# Altium project insoleDAQ.PrjPcb
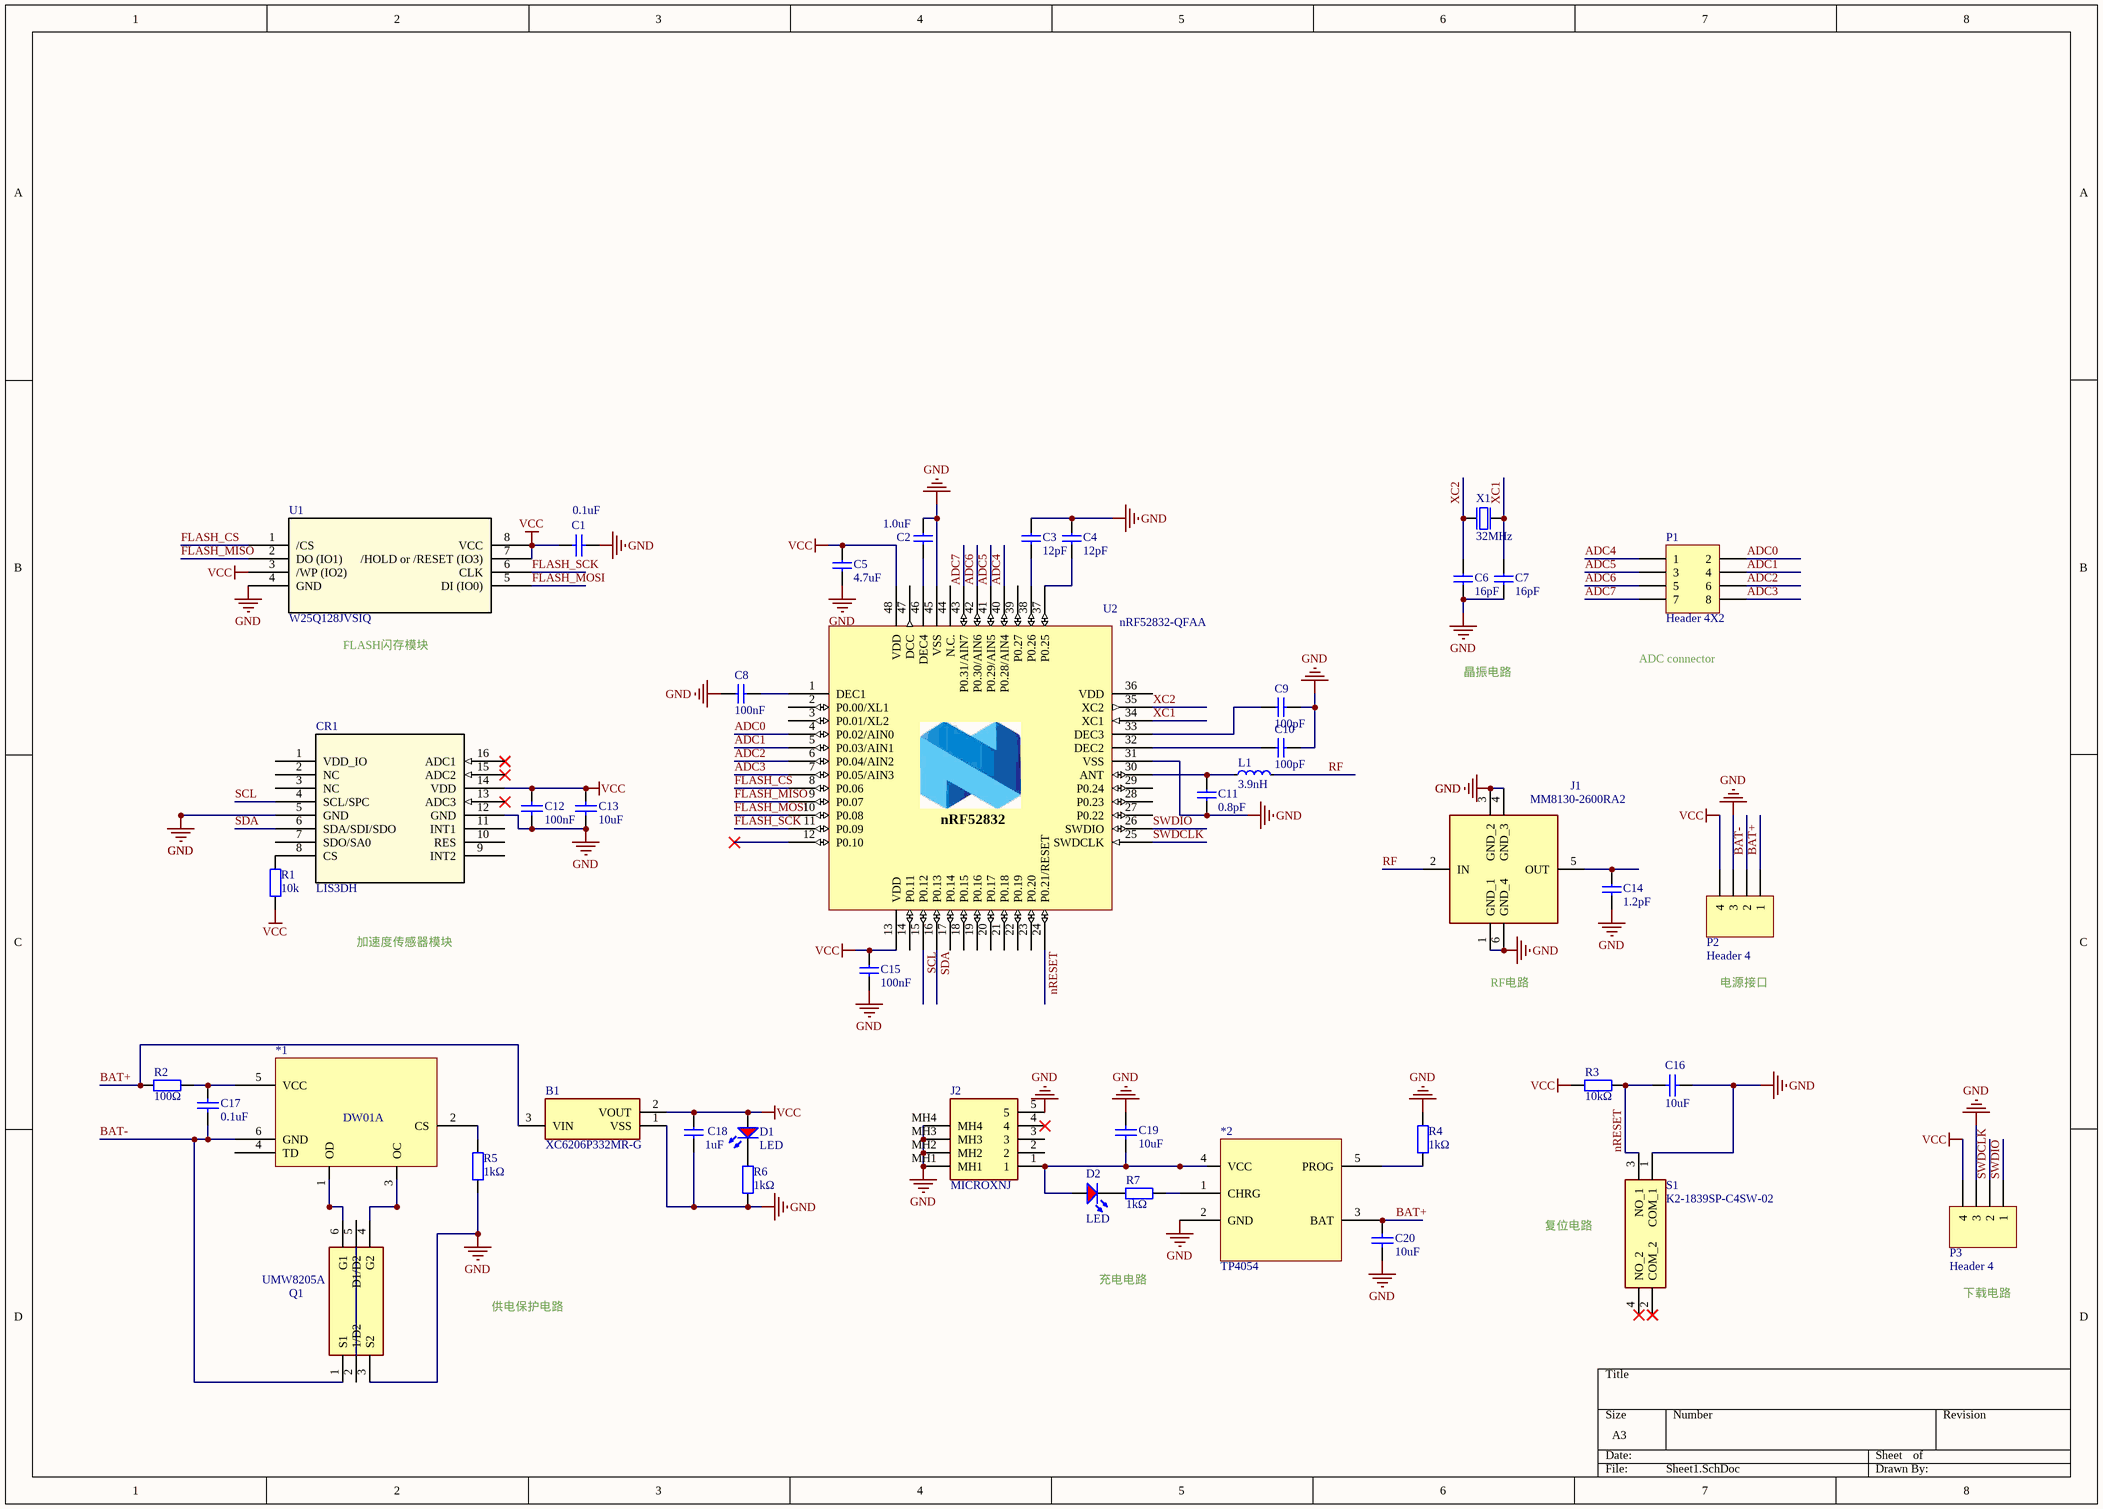
[diagram p0: Sheet1.SchDoc]
1 sheet, 44 parts. Net scope: global (net labels, ports and power ports of the same name join across sheets).
Board file: PCB2.PcbDoc

## Sheet Sheet1.SchDoc
size A3; SheetNumber: 1; SheetTotal: 1

### Parts
*1  DW01A  [DW01]
*2  TP4054  [TP4054]
B1  XC6206P332MR-G  [SOT95P280X130-3N]
C1  0.1uF  [Cap-0603]
C2  1.0uF  [CAPC1608X06L]
C3  12pF  [CAPC1608X06L]
C4  12pF  [CAPC1608X06L]
C5  4.7uF  [CAPC1608X06L]
C6  16pF  [CAPC1608X06L]
C7  16pF  [CAPC1608X06L]
C8  100nF  [CAPC1608X06L]
C9  100pF  [CAPC1608X06L]
C10  100pF  [CAPC1608X06L]
C11  0.8pF  [CAPC1608X06L]
C12  100nF  [Cap-0603]
C13  10uF  [Cap-0603]
C14  1.2pF  [CAPC1608X06L]
C15  100nF  [CAPC1608X06L]
C16  10uF  [Cap-0603]
C17  0.1uF  [Cap-0603]
C18  1uF  [CAPC1608X06L]
C19  10uF  [Cap-0603]
C20  10uF  [Cap-0603]
CR1  LIS3DH  [LGA-16_3x3x1mm_STM]
D1  LED  [LED-0805]
D2  LED  [LED-0805]
J1  MM8130-2600RA2  [MM81302600RA2]
J2  MICROXNJ  [MICROXNJ]
L1  3.9nH  [INDC1608X06L]
P1  Header 4X2  [HDR2X4]
P2  Header 4  [HDR1X4]
P3  Header 4  [HDR1X4]
Q1  UMW8205A  [SOT95P285X140-6N]
R1  10k  [Res-0603]
R2  100Ω  [Res-0603]
R3  10kΩ  [Res-0603]
R4  1kΩ  [Res-0603]
R5  1kΩ  [Res-0603]
R6  1kΩ  [Res-0603]
R7  1kΩ  [Res-0603]
S1  K2-1839SP-C4SW-02  [K21839SPC4SW02]
U1  W25Q128JVSIQ  [SOIC_128JVSIQ_WIN]
U2  nRF52832-QFAA  [QFN40P600X600X90-48N]
X1  32MHz  [BT-XTAL_2016]

### Nets
GND: *2.2(GND) B1.1(VSS) C1.2 C2.2 C3.2 C4.2 C5.1 C6.2 C7.2 C8.1 C9.2 C10.2 C11.1 C12.1 C13.1 C14.1 C15.1 C16.1 C18.1 C19.2 C20.2 CR1.5(GND) CR1.12(GND) J1.1(GND_1) J1.3(GND_2) J1.4(GND_3) J1.6(GND_4) J2.5 J2.MH1 J2.MH2 J2.MH3 J2.MH4 P2.3 P3.3 Q1.3(S2) R4.2 R5.1 R6.1 S1.1(COM_1) U1.4(GND) U2.31(VSS) U2.45(VSS) U2.49(GND) X1.2(GND) X1.4(GND)
VCC: B1.2(VOUT) C1.1 C5.2 C12.2 C13.2 C15.2 C18.2 CR1.14(VDD) D1.1(A) P2.4 P3.4 R1.2 R3.1 U1.3(/WP_(IO2)) U1.7(/HOLD_or_/RESET_(IO3)) U1.8(VCC) U2.13(VDD) U2.48(VDD)
ADC0: P1.2 U2.4(P0.02/AIN0)
ADC1: P1.4 U2.5(P0.03/AIN1)
ADC2: P1.6 U2.6(P0.04/AIN2)
ADC3: P1.8 U2.7(P0.05/AIN3)
ADC4: P1.1 U2.40(P0.28/AIN4)
ADC5: P1.3 U2.41(P0.29/AIN5)
ADC6: P1.5 U2.42(P0.30/AIN6)
ADC7: P1.7 U2.43(P0.31/AIN7)
BAT+: *2.3(BAT) B1.3(VIN) C20.1 P2.1 R2.2
BAT-: *1.6(GND) C17.1 P2.2 Q1.1(S1)
FLASH_CS: U1.1(/CS) U2.8(P0.06)
FLASH_MISO: U1.2(DO_(IO1)) U2.9(P0.07)
FLASH_MOSI: U1.5(DI_(IO0)) U2.10(P0.08)
FLASH_SCK: U1.6(CLK) U2.11(P0.09)
nRESET: C16.2 R3.2 S1.3(NO_1) U2.24(P0.21/RESET)
RF: J1.2(IN) L1.2
SCL: CR1.4(SCL/SPC) U2.15(P0.12)
SDA: CR1.6(SDA/SDI/SDO) U2.16(P0.13)
SWDCLK: P3.2 U2.25(SWDCLK)
SWDIO: P3.1 U2.26(SWDIO)
XC1: C7.1 U2.34(XC1) X1.1(inp)
XC2: C6.1 U2.35(XC2) X1.3(out)
Net*1_1: *1.1(OD) Q1.6(G1)
Net*1_2: *1.2(CS) R5.2
Net*1_3: *1.3(OC) Q1.4(G2)
Net*1_5: *1.5(VCC) C17.2 R2.1
Net*2_1: *2.1(CHRG) R7.1
Net*2_4: *2.4(VCC) C19.1 D2.1(A) J2.1
Net*2_5: *2.5(PROG) R4.1
NetC2_1: C2.1 U2.46(DEC4)
NetC3_1: C3.1 U2.38(P0.26)
NetC4_1: C4.1 U2.37(P0.25)
NetC8_2: C8.2 U2.1(DEC1)
NetC9_1: C9.1 U2.33(DEC3)
NetC10_1: C10.1 U2.32(DEC2)
NetC11_2: C11.2 L1.1 U2.30(ANT)
NetC14_2: C14.2 J1.5(OUT)
NetCR1_8: CR1.8(CS) R1.1
NetD1_2: D1.2(K) R6.2
NetD2_2: D2.2(K) R7.2

Not connected (* = marked no-connect by the designer): *1 4(TD); CR1 1(VDD_IO) 2(NC) 3(NC) 7(SDO/SA0) 9(INT2) 10(RES) 11(INT1) 13(ADC3)* 15(ADC2)* 16(ADC1)*; J2 2 3 4*; Q1 2(1/D2) 5(D1/D2); S1 2(COM_2)* 4(NO_2)*; U2 2(P0.00/XL1) 3(P0.01/XL2) 12(P0.10)* 14(P0.11) 17(P0.14) 18(P0.15) 19(P0.16) 20(P0.17) 21(P0.18) 22(P0.19) 23(P0.20) 27(P0.22) 28(P0.23) 29(P0.24) 36(VDD) 39(P0.27) 44(N.C.) 47(DCC)

### Notes on the sheet
- FLASH闪存模块
- 晶振电路
- ADC connector
- 加速度传感器模块
- RF电路
- 电源接口
- 复位电路
- 供电保护电路
- 充电电路
- 下载电路
- (in symbol nRF52832_QFAA) nRF52832

### Library data of the parts
*1 = DW01: 锂电池放电能量管理芯片
*2 = TP4054: 充电管理芯片
B1 = XC6206P332MR-G: LDO Voltage Regulators; Manufacturer_Name: Torex; Geometry.Height: 1.3mm; Manufacturer_Part_Number: XC6206P332MR-G; Mouser Part Number: 865-XC6206P332MR-G; Mouser Price/Stock: https://www.mouser.co.uk/ProductDetail/Torex-Semiconductor/XC6206P332MR-G?qs=AsjdqWjXhJ%2FXxNpRY3zZ8g%3D%3D; Arrow Part Number: *; Arrow Price/Stock: *; Mouser Testing Part Number: *; Mouser Testing Price/Stock: *; Datasheet Link: https://www.torexsemi.com/file/xc6206/XC6206.pdf
C1 C12 C13 C16 C17 C19 C20 = Cap
C2-C11 C14 C15 C18 = CAP_0603: Capacitor, X5R, ±10%; Part Number: C0603-4µ7; Note: 6.3V; Artikkelnr Noca: 20069060; Artikkelnr Simpro: N.A.; Manufacturer: *; Manufacturer Part Number: *; Datasheet: *; LatestRevisionDate: 2009-11-23; Pin Count: 2; Publisher: Nordic Semiconductor; Published: 2009-05-08; Supplier: *; Supplier part number: *; 2nd source Supplier: *; 2nd source part number: *; Footprint Doc: 0603
  C2: Value: 1.0uF
  C3 C4: Value: 12pF
  C5: Value: 4.7uF
  C6 C7: Value: 16pF
  C8 C15: Value: 100nF
  C9 C10: Value: 100pF
  C11: Value: 0.8pF
  C14: Value: 1.2pF
  C18: Value: 1uF
CR1 = LIS3DH: 加速度传感器模块; Mfr_Name: STMicroelectronics; Type: DEV; Copyright: Copyright (C) 2023 Ultra Librarian. All rights reserved.; Manufacturer_Part_Number: LIS3DH; RefDes: RefDes
D1 D2 = LED: 充电指示灯
J1 = MM8130-2600RA2: Connector; Manufacturer_Name: Murata Electronics; Datasheet Link: https://datasheet.datasheetarchive.com/originals/distributors/Datasheets_SAMA/589e44b7d5a6bf6f2f6a9b110e94adf4.pdf; Height: 1.5mm; Manufacturer_Part_Number: MM8130-2600RA2; Mouser Part Number: 81-MM8130-2600RA2; Mouser Price/Stock: https://www.mouser.co.uk/ProductDetail/Murata-Electronics/MM8130-2600RA2?qs=pwh76yelNxAj%2FSz0%2FLo03A%3D%3D; Arrow Part Number: MM8130-2600RA2; Arrow Price/Stock: https://www.arrow.com/en/products/mm8130-2600ra2/murata-manufacturing?region=nac
J2 = MICROXNJ: Connector; Manufacturer_Name: Shou Han; Datasheet Link: https://datasheet.lcsc.com/szlcsc/1912111437_SHOU-HAN-MicroXNJ_C404969.pdf; Height: 2.425mm; Manufacturer_Part_Number: MICROXNJ
L1 = IND_0603: Chip inductor, IDC,min = 50 mA, ±20%; Part Number: L0603-10µ; Manufacturer: Taiyo Yuden; Manufacturer Part Number: LBMF1608T100K; 2nd source part number: 178-6105; Note: LBMF1608T100K 10µH 80mA 0603; Artikkelnr Noca: 33029314; Artikkelnr Simpro: N.A.; Datasheet: http://www.yuden.co.jp/ut/product/pdf/elb2_e.pdf; LatestRevisionDate: 2012-09-19; Pin Count: 2; Publisher: Nordic Semiconductor; Published: 2010-02-24; Value: 3.9nH; Supplier: Digi-Key; Supplier part number: 587-1714-1-ND; 2nd source Supplier: Farnell; Footprint Doc: 0603
P1 = Header 4X2: Header, 4-Pin, Dual row; LatestRevisionDate: 17-Jul-2002; LatestRevisionNote: Re-released for DXP Platform.; Publisher: Altium Limited
P2 P3 = Header 4: Header, 4-Pin; LatestRevisionDate: 17-Jul-2002; LatestRevisionNote: Re-released for DXP Platform.; Publisher: Altium Limited
Q1 = UMW8205A: MOSFET (N-Channel); Manufacturer_Name: UMW; Datasheet Link: https://datasheet.lcsc.com/szlcsc/1904151404_Youtai-Semiconductor-Co-Ltd-UMW8205A_C351449.pdf; Height: 1.4mm; Manufacturer_Part_Number: UMW8205A
R1-R7 = Res
S1 = K2-1839SP-C4SW-02: Switch; Manufacturer_Name: Korean Hroparts Elec; Datasheet Link: https://datasheet.lcsc.com/szlcsc/2003231806_Korean-Hroparts-Elec-K2-1839SP-C4SW-02_C164133.pdf; Height: 7.5mm; Manufacturer_Part_Number: K2-1839SP-C4SW-02
U1 = W25Q128JVSIQ: 128M闪存; Mfr_Name: Winbond; Copyright: Copyright (C) 2023 Ultra Librarian. All rights reserved.; Manufacturer_Part_Number: W25Q128JVSIQ; RefDes: RefDes; Type: DEV
U2 = nRF52832_QFAA: Multi-protocol Bluetooth Low Energy, ANT and 2.4GHz proprietary system-on-chip; Manufacturer: Nordic Semiconductor; Artikkelnr Noca: N.A.; Part Number: nRF52832-QFAA; Manufacturer Part Number: nRF52832-QFAA; Datasheet: *; LatestRevisionDate: 2014-11-26; Pin Count: 48; Publisher: Nordic Semiconductor; Published: 2014-11-26; Value: nRF52832-QFAA; Note: *; Supplier: Nordic Semiconductor; Supplier part number: *; 2nd source Supplier: *; 2nd source part number: *; Footprint Doc: QFN-48; Artikkelnr Simpro: N.A.
X1 = XTAL_SMD2016: XTAL SMD 2016, 32MHz, Cl=12pF, Total Tol: ±10ppm; Part Number: XTAL_SMD2016_32MHz_8pF_Epson; Manufacturer: Epson Toyocom; Manufacturer Part Number: Q22FA12800025; Note: XTAL SMD 32.000MHz; Artikkelnr Noca: N.A.; Datasheet: http://www.epsondevice.com/docs/qd/en/DownloadServlet?id=ID000449; LatestRevisionDate: 2014-11-27; Pin Count: 4; Publisher: Nordic Semiconductor; Published: 2012-03-09; Value: 32MHz; Supplier: Farnell; Supplier part number: 171-2806; 2nd source Supplier: *; 2nd source part number: *; Footprint Doc: XTAL_2016; Artikkelnr Simpro: N.A.